# EAGLE design SideYSolarPanel (EAGLE 6.6.0)
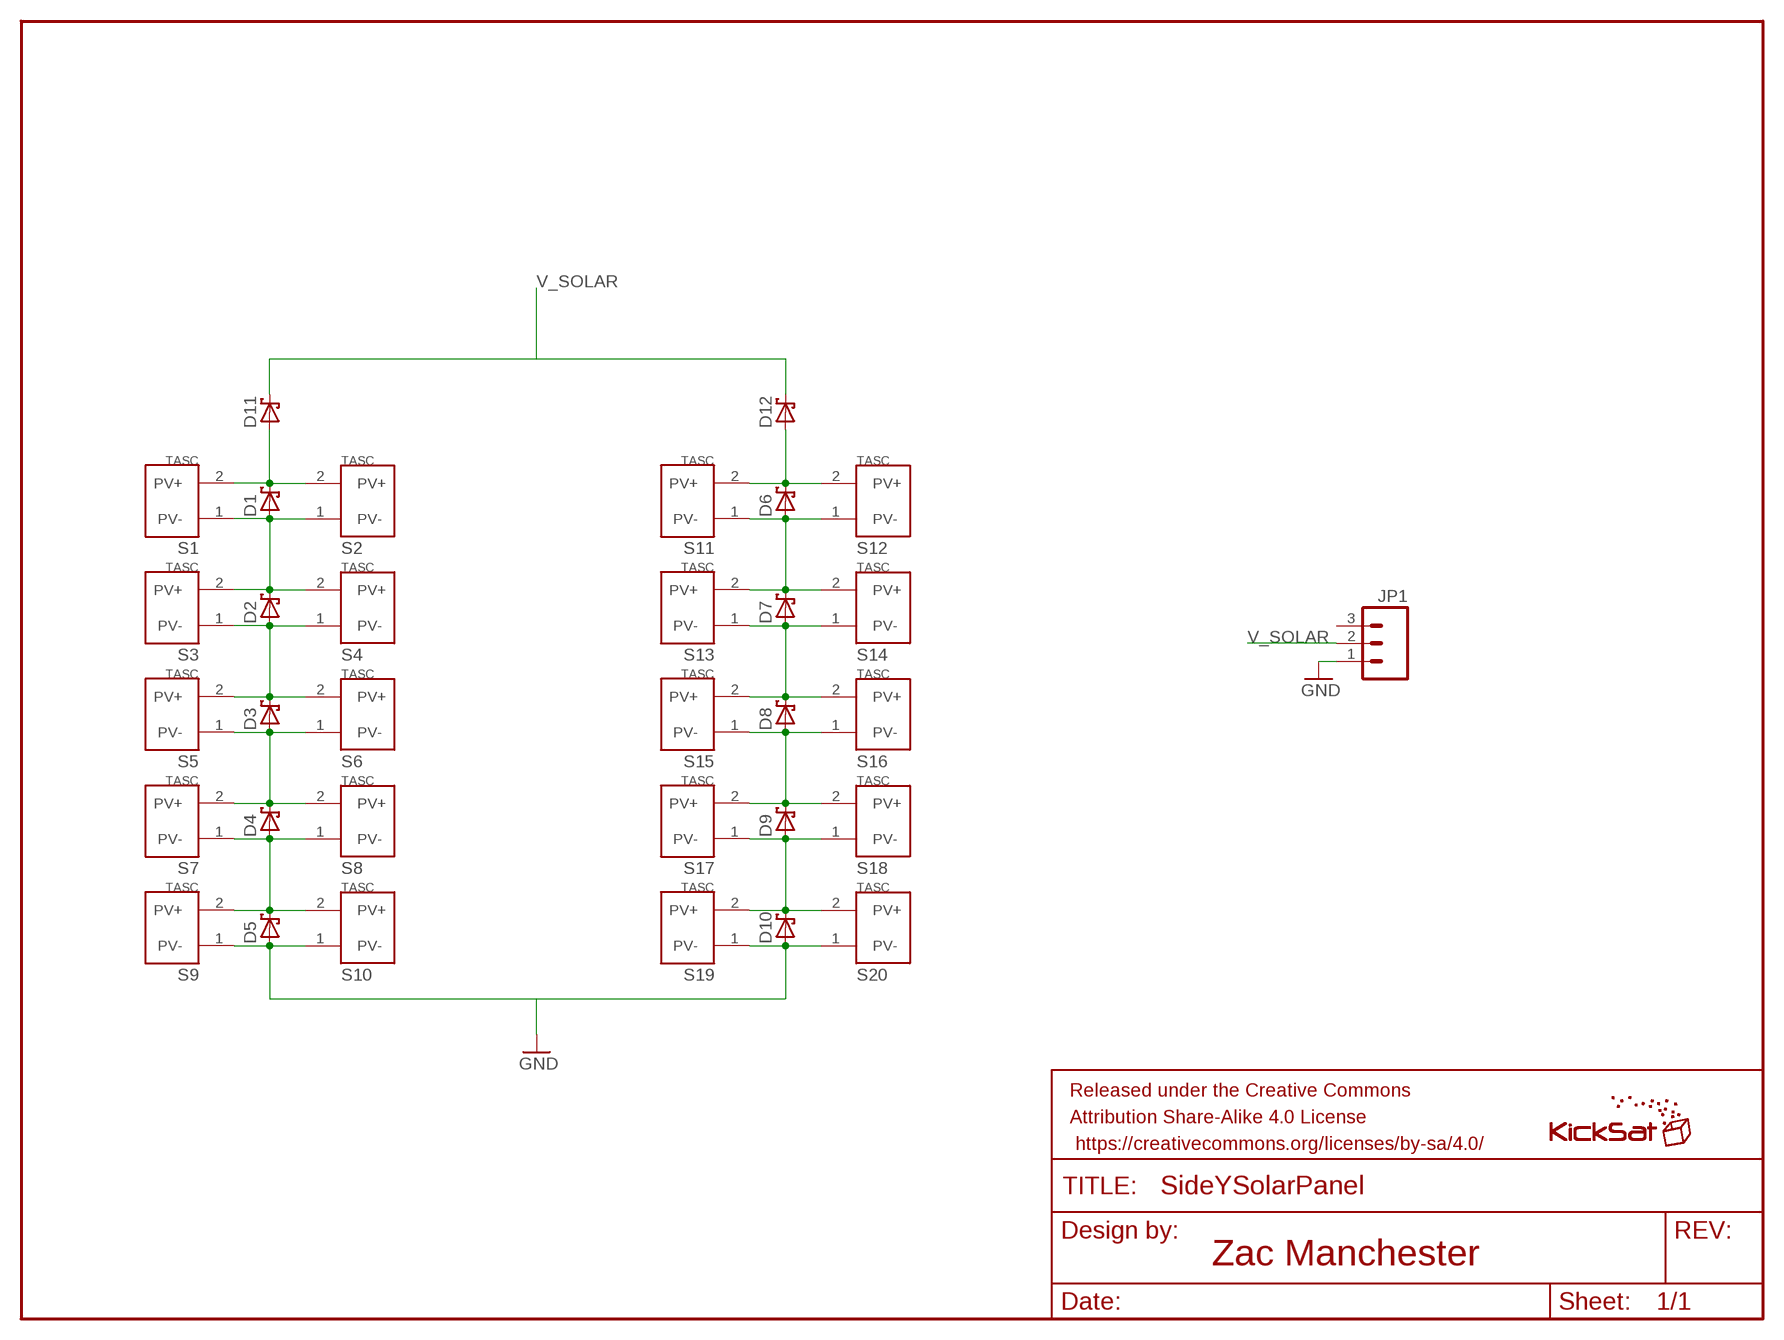
[diagram p0: schematic, sheet 1]

## Parts
D1  SB_DIODE  [SB_DIODE]
D2  SB_DIODE  [SB_DIODE]
D3  SB_DIODE  [SB_DIODE]
D4  SB_DIODE  [SB_DIODE]
D5  SB_DIODE  [SB_DIODE]
D6  SB_DIODE  [SB_DIODE]
D7  SB_DIODE  [SB_DIODE]
D8  SB_DIODE  [SB_DIODE]
D9  SB_DIODE  [SB_DIODE]
D10  SB_DIODE  [SB_DIODE]
D11  SB_DIODE  [SB_DIODE]
D12  SB_DIODE  [SB_DIODE]
FRAME1  FRAME-LETTER  [CREATIVE_COMMONS]
JP1  M03POLAR_LOCK  [MOLEX-1X3_LOCK]
S1  SOLAR_CELL  [SOLAR_CELL]
S2  SOLAR_CELL  [SOLAR_CELL]
S3  SOLAR_CELL  [SOLAR_CELL]
S4  SOLAR_CELL  [SOLAR_CELL]
S5  SOLAR_CELL  [SOLAR_CELL]
S6  SOLAR_CELL  [SOLAR_CELL]
S7  SOLAR_CELL  [SOLAR_CELL]
S8  SOLAR_CELL  [SOLAR_CELL]
S9  SOLAR_CELL  [SOLAR_CELL]
S10  SOLAR_CELL  [SOLAR_CELL]
S11  SOLAR_CELL  [SOLAR_CELL]
S12  SOLAR_CELL  [SOLAR_CELL]
S13  SOLAR_CELL  [SOLAR_CELL]
S14  SOLAR_CELL  [SOLAR_CELL]
S15  SOLAR_CELL  [SOLAR_CELL]
S16  SOLAR_CELL  [SOLAR_CELL]
S17  SOLAR_CELL  [SOLAR_CELL]
S18  SOLAR_CELL  [SOLAR_CELL]
S19  SOLAR_CELL  [SOLAR_CELL]
S20  SOLAR_CELL  [SOLAR_CELL]
U$1  KICKSAT_LOGO  [KICKSAT_LOGO]

## Nets
GND: D5.POS D10.POS JP1.1 S9.1(PV-) S10.1(PV-) S19.1(PV-) S20.1(PV-)
N$1: D6.POS D7.NEG S11.1(PV-) S12.1(PV-) S13.2(PV+) S14.2(PV+)
N$5: D6.NEG D12.POS S11.2(PV+) S12.2(PV+)
N$7: D7.POS D8.NEG S13.1(PV-) S14.1(PV-) S15.2(PV+) S16.2(PV+)
N$9: D1.NEG D11.POS S1.2(PV+) S2.2(PV+)
N$36: D8.POS D9.NEG S15.1(PV-) S16.1(PV-) S17.2(PV+) S18.2(PV+)
N$37: D2.POS D3.NEG S3.1(PV-) S4.1(PV-) S5.2(PV+) S6.2(PV+)
N$39: D3.POS D4.NEG S5.1(PV-) S6.1(PV-) S7.2(PV+) S8.2(PV+)
N$41: D9.POS D10.NEG S17.1(PV-) S18.1(PV-) S19.2(PV+) S20.2(PV+)
N$45: D1.POS D2.NEG S1.1(PV-) S2.1(PV-) S3.2(PV+) S4.2(PV+)
N$50: D4.POS D5.NEG S7.1(PV-) S8.1(PV-) S9.2(PV+) S10.2(PV+)
V_SOLAR: D11.NEG D12.NEG JP1.2
Unconnected: JP1.3

## Notes on the sheet
- Zac Manchester

## Library data of the parts
D1-D12 = Solar:SB_DIODE
FRAME1 = SparkFun-Aesthetics:FRAME-LETTER: Schematic Frame Standard 8.5x11 US Letter frame
JP1 = SparkFun-Connectors:M03: Header 3 Standard 3-pin 0.1" header. Use with straight break away headers (SKU : PRT-00116), right angle break away headers (PRT-00553), swiss pins (PRT-00743), machine pins (PRT-00117), and female headers (PRT-00115). Molex polarized connector foot print use with SKU : PRT-08232 with associated crimp pins and housings.
S1-S20 = Solar:SOLAR_CELL
U$1 = KickSat-Logo:KICKSAT_LOGO

## Board
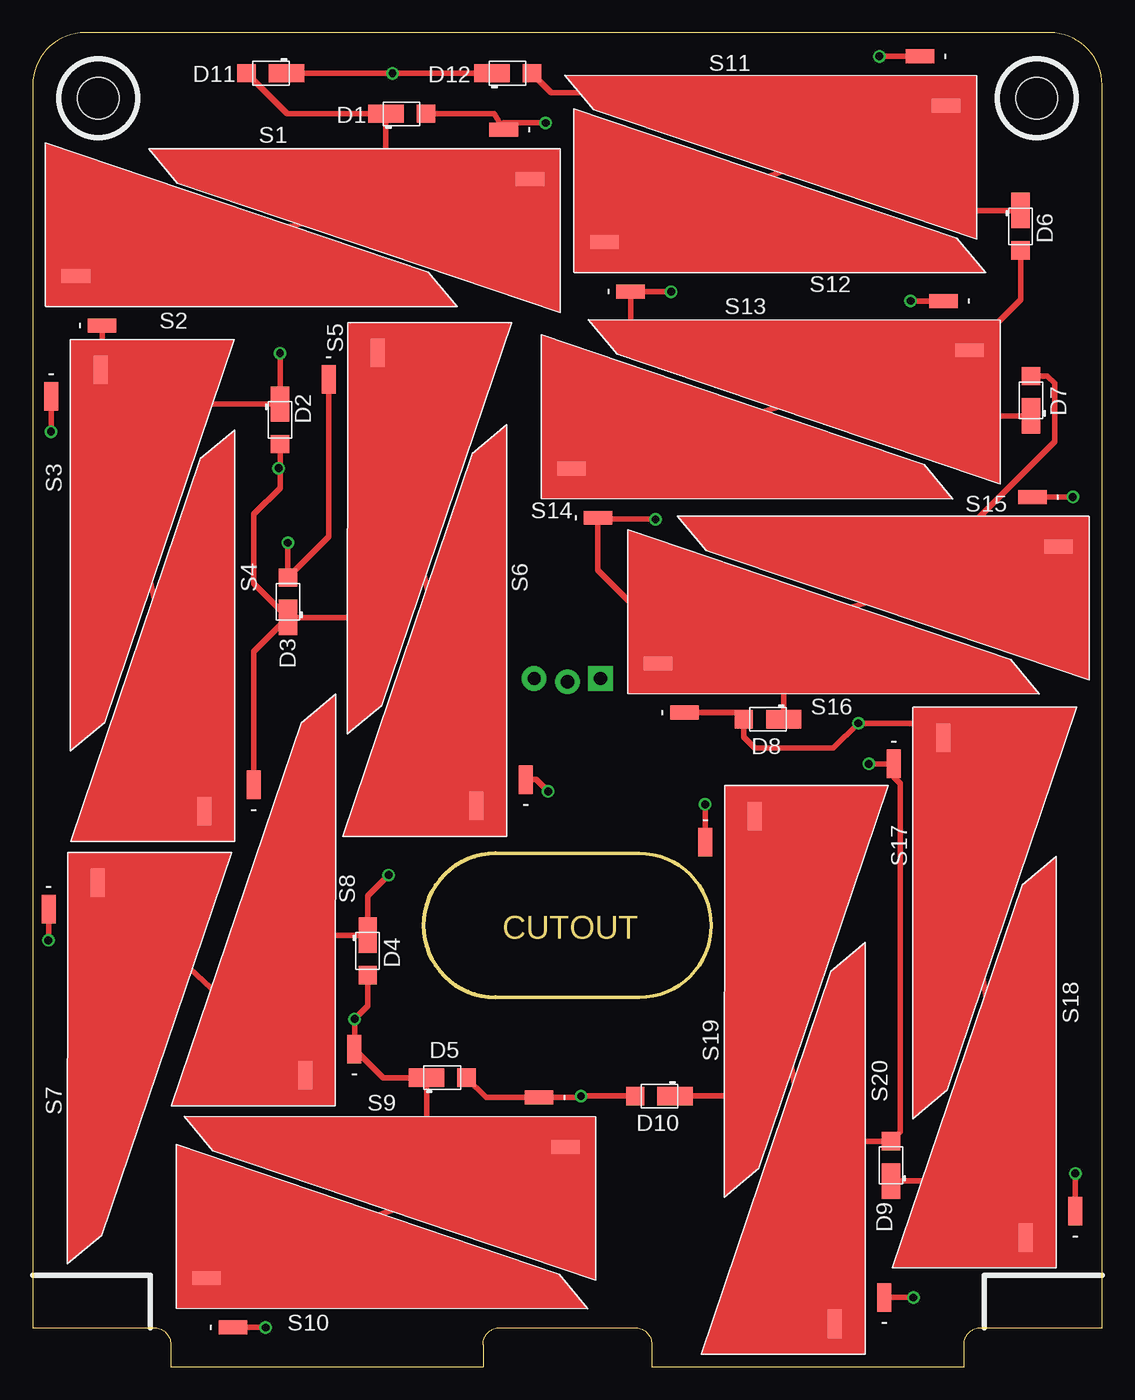
[diagram p1: board, top side]
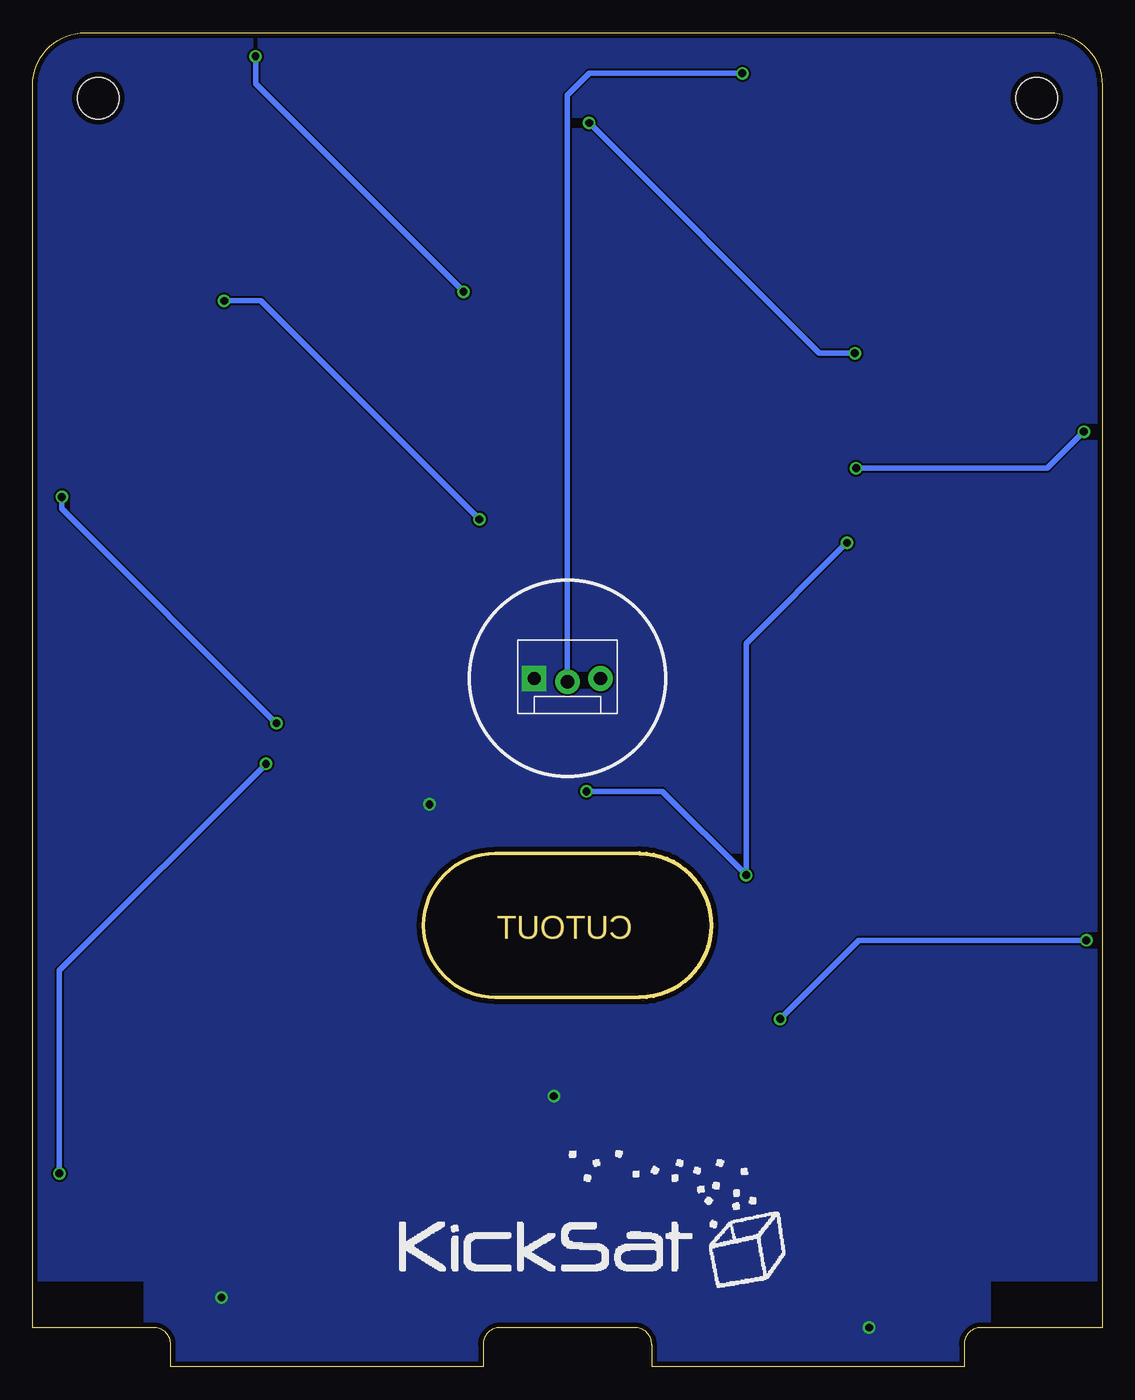
[diagram p2: board, bottom side, seen from below]

Size 81.73 x 102 mm. Coordinates in mm from the lower left corner, seen from the top.
Outline: 81.73,3 81.73,98 arc90 77.73,102 4,102 arc90 0,98 0,3 9.25,3 arc-90 10.55,1.7 10.55,0 34.41,0 34.41,1.7 arc-90 35.72,3 46.02,3 arc-90 47.31,1.7 47.31,0 71.18,0 71.18,1.7 arc-90 72.48,3 81.73,3
Outline: 35.37,28.25 46.37,28.25 arc180 46.37,39.25 35.37,39.25 arc180 35.37,28.25
Copper layers (1*16): Top 0.0356mm / dielectric 1.5011mm / Bottom 0.0356mm
Design rules "OSHPark-2layer": minimum track width 6mil, minimum drill 13mil, track to track 6mil, track to pad 6mil, pad to pad 6mil, via to via 6mil, smd to smd 6mil, copper to edge 15mil, drill to drill 6mil, minimum pad ring 7mil, minimum via ring 7mil, stop-mask expansion 4mil, vias tented up to drill 0mil, thermal gap 10mil
Holes 3.2 mm at 5,97 76.73,97

### Footprints (pad centres in the part's own frame; a part is rotated, then mirrored left to right if it is on the bottom)
SB_DIODE = smd 2.7 x 1.4: NEG -1.2,0 | smd 1.4 x 1.4: POS 1.85,0
MOLEX-1X3_LOCK = drill 1.016 pad 1.88 square: 1 0,0.127 | drill 1.016 pad 1.88: 2 2.54,-0.127; 3 5.08,0.127
SOLAR_CELL = smd 1.067 x 2.184: 1 -1.589,2.999; 2 2.187,5.011

### Placement (x,y rotation side)
D1  28.2,95.8 0 top
D2  18.9,72.4 270 top
D3  19.5,58.5 90 top
D4  25.6,31.8 270 top
D5  31.3,22.1 0 top
D6  75.5,87.2 270 top
D7  76.3,73.9 90 top
D8  56.2,49.5 180 top
D9  65.6,15.4 90 top
D10  47.9,20.7 180 top
D11  18.2,98.9 180 top
D12  36.3,98.9 0 top
FRAME1  20.8,-7.6 0 top  (outside the outline)
JP1  43.41,52.5 0 bottom
S1  33,93 270 top
S2  8.3,81.2 90 top
S3  3,71.2 0 top
S4  15.3,47.5 180 top
S5  24.2,72.5 0 top
S6  36.1,47.9 180 top
S7  2.8,32 0 top
S8  23,27.3 180 top
S9  35.7,19 270 top
S10  18.3,4.6 90 top
S11  64.8,98.6 270 top
S12  48.7,83.8 90 top
S13  66.6,79.9 270 top
S14  46.2,66.5 90 top
S15  73.4,64.9 270 top
S16  52.8,51.6 90 top
S17  67.4,43.1 0 top
S18  78.1,14.9 180 top
S19  53,37.1 0 top
S20  63.5,8.3 180 top
U$1  54.2,5.8 0 bottom

### Tracks (layer width: path | path; a pad name or v marks a point on that pad's centre or on a via)
GND  (via drill 0.6)
  Top 0.406: S10.1 v17.8,3.01 v17.8,3 | S20.1 v67.3,5.3 | 51.1,39.5 S19.1 51.41,42.99 v51.4,43 | D5.POS 34.66,20.59 S9.1 41.9,20.59 v41.9,20.7 D10.POS
  Bottom 0.406: v17.8,3 18.1,3 18.1,2.9 | v41.9,20.7 42,20.7 42,20.8 | v67.3,5.3 67.4,5.3 67.4,5.2 | v51.4,43 51.3,43.1
  pour Bottom (no thermals): 81.73,7 81.73,98 arc90 77.73,102 4,102 arc90 0,98 0,7 9,7 9,3 10.6,3 10.6,0 34.4,0 34.4,3 47.3,3 47.3,0 71.2,0 71.2,3 72.73,3 72.73,7
N$1  (via drill 0.6)
  Top 0.406: S13.2 58.24,73.75 | 58.24,73.75 S14.2 | D7.NEG 73.8,72.7 72.6,73.9 72.6,76.72 S13.2 | 58.24,73.75 53.79,78.2 45.8,78.2 45.7,78.3 S12.1 45.71,82.2 v48.8,82.2 | S13.2 75.5,81.6 D6.POS | S11.1 64.71,100.19 v64.7,100.2
  Bottom 0.406: v64.7,100.2 64.7,98.1 v48.8,82.2
N$5
  Top 0.406: 63.26,93.8 S11.2 69.81,97.01 70.2,97.4 39.65,97.4 D12.POS | 63.26,93.8 S12.2 | D6.NEG 68.66,88.4 63.26,93.8
N$7  (via drill 0.6)
  Top 0.406: S16.2 49.76,54.36 | 49.76,54.36 55.65,56.08 | 55.65,56.08 66.66,59.29 | 66.66,59.29 S15.2 | D8.NEG 57.4,54.33 55.65,56.08 | 49.76,54.36 43.2,60.92 S14.1 43.31,64.8 v47.6,64.8 | D7.POS 77.55,75.75 78.1,75.2 78.1,70.73 66.66,59.29 | S13.1 67.11,81.49 v67.1,81.5
  Bottom 0.406: v67.1,81.5 64.3,81.5 v47.6,64.8
N$9
  Top 0.406: S1.2 27.8,89.1 | 27.8,89.1 S2.2 | 27.8,89.1 27,89.9 D1.NEG 19.45,95.8 D11.POS
N$36  (via drill 0.6)
  Top 0.406: S18.2 75.19,14.26 | 75.19,14.26 S17.2 68.5,49.2 v63.1,49.2 61.2,47.3 55.2,47.3 54.35,48.15 D8.POS 53.84,50.01 S16.1 | D9.NEG 75.12,14.2 75.19,14.26 | S15.1 79.49,66.49 v79.5,66.5
  Bottom 0.406: v79.5,66.5 79.5,65.6 v63.1,49.2
N$37  (via drill 0.6)
  Top 0.406: S5.2 29.68,61.52 | 29.68,61.52 S6.2 | D3.NEG 25.45,57.3 29.68,61.52 | S4.1 16.89,54.69 D3.NEG | v18.8,68.7 18.9,68.8 D2.POS 18.9,67.2 16.9,65.2 16.9,59.9 D3.NEG | S3.1 1.41,71.51 v1.4,71.5
  Bottom 0.406: v18.8,68.7 4.2,68.7 v1.4,71.5
N$39  (via drill 0.6)
  Top 0.406: S8.2 15.26,27.45 | 15.26,27.45 S7.2 | 15.26,27.45 20.81,33 D4.NEG 25.6,36 v27.2,37.6 | v39.4,44 38.5,44.9 S6.1 | S5.1 22.61,63.46 D3.POS v19.5,63
  Bottom 0.406: v39.4,44 33.6,44 v27.2,37.6 27.2,55.3 v19.5,63
N$41  (via drill 0.6)
  Top 0.406: S19.2 57.72,24.64 | 57.72,24.64 58.98,17.18 | 58.98,17.18 S20.2 | D10.NEG 53.79,20.7 57.72,24.64 | 58.98,17.18 59.05,17.25 D9.POS 66.3,17.95 66.3,44.6 65.81,45.09 S17.1 v63.9,46.1 | S18.1 v79.69,14.79 v79.7,14.8
  Bottom 0.406: v79.69,14.79 79.69,30.31 v63.9,46.1
N$45  (via drill 0.6)
  Top 0.406: S4.2 5.31,75.68 | 5.31,75.68 S3.2 5.3,76.33 S2.1 | 5.31,75.68 5.31,73.6 D2.NEG v18.9,77.5 | D1.POS 35.29,95.8 S1.1 36.01,95.1 v39.2,95.1
  Bottom 0.406: v18.9,77.5 21.6,77.5 v39.2,95.1
N$50  (via drill 0.6)
  Top 0.406: S10.2 31,13.26 | 31,13.26 S9.2 | 31,13.26 30.1,14.16 D5.NEG 26.79,22.1 S8.1 24.6,24.31 v24.6,26.6 25.6,27.6 D4.POS | S7.1 1.21,32.61 v1.2,32.6
  Bottom 0.406: v1.2,32.6 18.6,32.6 v24.6,26.6
V_SOLAR  (via drill 0.6)
  Top 0.406: D12.NEG v27.5,98.9 D11.NEG
  Bottom 0.406: JP1.2 40.87,97.23 39.2,98.9 v27.5,98.9

### Text on the board
Dimension: CUTOUT